# Altium schematic sheet controleRemoto.SchDoc
size A4; DrawnBy: Dyego; Revision: 1; SheetNumber: 1; SheetTotal: 1; ProjectName: Fut Solar
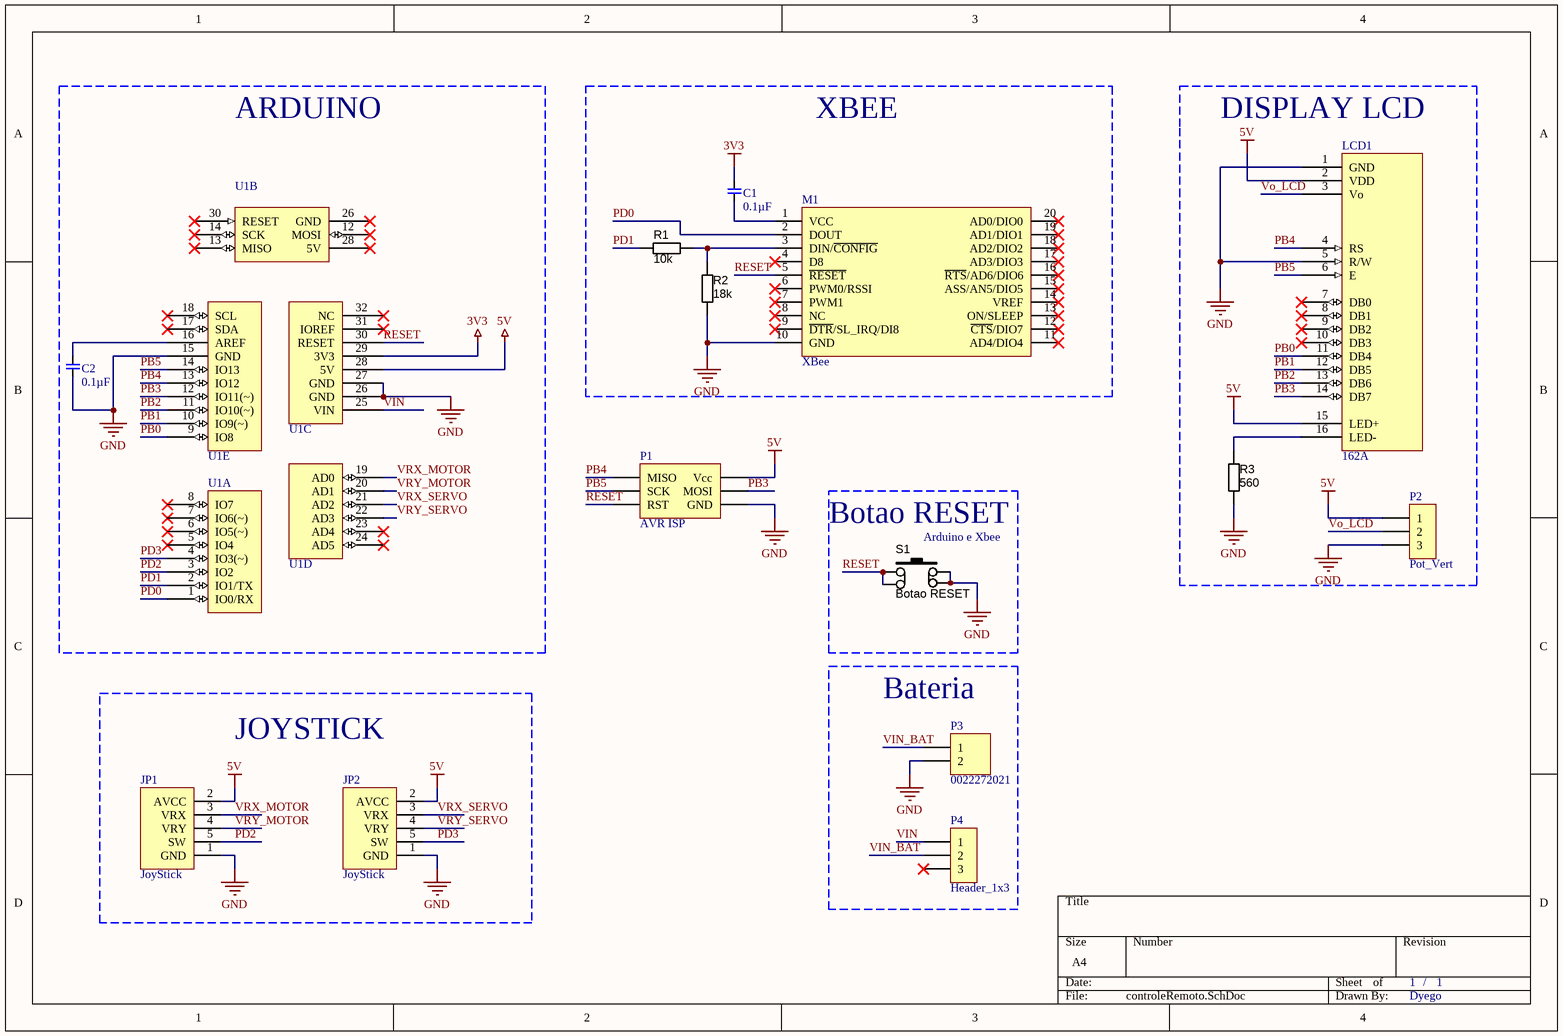
[diagram p0: controleRemoto.SchDoc]

## Parts
C1  0.1µF  [C100-200-100]
C2  0.1µF  [C100-200-100]
JP1  JoyStick  [Modulo Joystick Dual Eixo XY]
JP2  JoyStick  [Modulo Joystick Dual Eixo XY]
LCD1  162A  [DISPLAY 16x2]
M1  XBee  [XBee]
P1  AVR ISP  [HDR-M-2x3-2.54mm-180-9.2mm]
P2  Pot_Vert  [Pot_Vert]
P3  0022272021  [KK_2]
P4  Header_1x3  [Chave Alavanca MTS103]
R1  10k  [RESTH_AXIAL-0.4]
R2  18k  [RESTH_AXIAL-0.4]
R3  560  [RESTH_AXIAL-0.4]
S1  Botao RESET  [DTS-6.0mm-6.0mm-THT]
U1  Shield Arduino Uno Rv3 1  [Shield Arduino Uno Rv3 1]  (value not drawn)  (parts A,B,C,D,E of 5)

## Blocks framed on the sheet
ARDUINO: C2 U1
XBEE: C1 M1 R1 R2
DISPLAY LCD: LCD1 P2 R3
Botao RESET: S1
Bateria: P3 P4
JOYSTICK: JP1 JP2

## Nets
3V3: C1.2 U1.29(3V3)
5V: JP1.2(AVCC) JP2.2(AVCC) LCD1.2(VDD) LCD1.15(LED+) P1.2(Vcc) P2.1 U1.28(5V)
GND: C2.1 JP1.1(GND) JP2.1(GND) LCD1.1(GND) LCD1.5(R/W) M1.10(GND) P1.6(GND) P2.3 P3.2 R2.2 R3.2 S1.2 U1.15(GND) U1.26(GND) U1.27(GND)
PB0: LCD1.11(DB4) U1.9(IO8)
PB1: LCD1.12(DB5) U1.10(IO9(~))
PB2: LCD1.13(DB6) U1.11(IO10(~))
PB3: LCD1.14(DB7) P1.4(MOSI) U1.12(MOSI)
PB4: LCD1.4(RS) P1.1(MISO) U1.13(MISO)
PB5: LCD1.6(E) P1.3(SCK) U1.14(SCK)
PD0: M1.2(DOUT) U1.1(IO0/RX)
PD1: R1.1 U1.2(IO1/TX)
PD2: JP1.5(SW) U1.3(IO2)
PD3: JP2.5(SW) U1.4(IO3(~))
RESET: M1.5(~{RESET}) P1.5(RST) S1.1 U1.30(RESET)
VIN: P4.1 U1.25(VIN)
VIN_BAT: P3.1 P4.2
Vo_LCD: LCD1.3(Vo) P2.2
VRX_MOTOR: JP1.3(VRX) U1.19(AD0)
VRX_SERVO: JP2.3(VRX) U1.21(AD2)
VRY_MOTOR: JP1.4(VRY) U1.20(AD1)
VRY_SERVO: JP2.4(VRY) U1.22(AD3)
NetC1_1: C1.1 M1.1(VCC)
NetC2_2: C2.2 U1.16(AREF)
NetLCD1_16: LCD1.16(LED-) R3.1
NetM1_3: M1.3(DIN/~{CONFIG}) R1.2 R2.1

Not connected (* = marked no-connect by the designer): LCD1 7(DB0)* 8(DB1)* 9(DB2)* 10(DB3)*; M1 4(D8)* 6(PWM0/RSSI)* 7(PWM1)* 8(NC)* 9(~{DTR}/SL_IRQ/DI8)* 11(AD4/DIO4)* 12(~{CTS}/DIO7)* 13(ON/SLEEP)* 14(VREF)* 15(ASS/AN5/DIO5)* 16(~{RTS}/AD6/DIO6)* 17(AD3/DIO3)* 18(AD2/DIO2)* 19(AD1/DIO1)* 20(AD0/DIO0)*; P4 3*; U1 5(IO4)* 6(IO5(~))* 7(IO6(~))* 8(IO7)* 17(SDA)* 18(SCL)* 23(AD4)* 24(AD5)* 31(IOREF)* 32(NC)*

## Notes on the sheet
- (near S1) Arduino e Xbee
- /

## Library data of the parts
C1 C2 = C320C104K1R5TA7301: Non-polarised capacitor; Manufacturer 1: Kemet; Description 1: CAP CER 0.1UF 100V 10% RADIAL; Category 1: Capacitors; Tolerance: ±10%; Voltage - Rated: 100V; Temperature Coefficient: X7R; Código: C320C104K1R5TA7301; PackageReference: C100-200-100; Supplier 1: Digi-Key; Supplier Part Number 1: 399-9868-1-ND; Manufacturer Part Number: C320C104K1R5TA7301; RoHS: RoHS Compliant; Stock 1: 9646; Pricing 1: 1=0.51, 10=0.49, 25=0.3468, 50=0.2922, 100=0.2375, 250=0.19728, 1000=0.16119 (EUR); Packaging: Cut Tape (CT); Capacitance: 0.1µF; Operating Temperature: -55°C ~ 125°C; Applications: General Purpose; Lead Spacing: 0.100" (2.54mm); Size / Dimension: 0.200" L x 0.125" W (5.08mm x 3.18mm); Height - Seated (Max): 0.260" (6.60mm); Mounting Type: Through Hole; Package / Case: Radial; ComponentLink1URL: http://www.kemet.com/Lists/ProductCatalog/Attachments/52/F3101_GoldMax.pdf; ComponentLink1Description: http://www.kemet.com/Lists/ProductCatalog/Attachments/52/F3101_GoldMax.pdf; Ratings: -; Thickness (Max): -; Features: -; Lead Style: Straight
JP1 JP2 = JoyStick: Description 1: Módulo Joystick Dual Eixo XY; Código: JoyStick; ManufacturerPartNumber: JoyStick; PackageReference: Modulo Joystick Dual Eixo XY; Manufacturer 1: JoyStick
LCD1 = LCM-S01602DTR/A: 16 char * 2 line LCD character display with b/light; Manufacturer 1: LUMEX; Fitted: True; Description 1: LUMEX - LCM-S01602DTR/A - DOT MATRIX LCD DISPLAY 16X2; Character Count x Line: 16 x 2; Backlighting Colour: No Backlight; Character Size: 5.56; Supply Voltage: 5; Display Mode: Reflective; Display Area Width: 52; Código: LCM-S01602DTR/A; ManufacturerPartNumber: LCM-S01602DTR/A; Footprint: DISPLAY 16X2; PackageReference: DISPLAY 16X2; Supplier 1: Newark; Supplier Part Number 1: 19J7660; RoHS: YES; Stock 1: 118; Pricing 1: 1=7,47, 5=7,47, 10=6,89, 100=6,89 (USD); ComponentLink1URL: http://www.farnell.com/datasheets/699613.pdf; ComponentLink1Description: http://www.farnell.com/datasheets/699613.pdf; Packaging: Each
M1 = XB24CZ7WIT-004: XBee RF Multipoint Module; Manufacturer 1: Digi International; Description 1: Zigbee / 802.15.4 Modules XBee ZB S2C TH Wire Antenna; Category 1: Zigbee / 802.15.4 Modules; Data Rate: 250 kbps; Frequency: 2.4 GHz; Sensitivity: - 100 dBm; Interface Type: SPI, UART; Operating Supply Voltage: 2.1 V to 3.6 V; Line of Sight Range: 4000 ft; Output Power: 3.1 mW; Antenna Connector Type: Integrated; Supply Current Receiving: 28 mA; Supply Current Transmitting: 33 mA; Product Status: New Product; Código: XB24CZ7WIT-004; ManufacturerPartNumber: XB24CZ7WIT-004; PackageReference: XBee; Supplier 1: Mouser; Supplier Part Number 1: 888-XB24CZ7WIT-004; RoHS: RoHS Compliant; Stock 1: 200; Pricing 1: 1=25.99 (AUD); Packaging: Tray; ComponentLink1URL: http://www.mouser.com/ds/2/111/ds_xbee_zigbee-709350.pdf; ComponentLink1Description: http://www.mouser.com/ds/2/111/ds_xbee_zigbee-709350.pdf; Brand: Digi International; Maximum Operating Temperature: + 85 C; Minimum Operating Temperature: - 40 C; RoHS - Mouser: Y; Minimum Order Quantity: 1; Reeling: False; Dimensions: 2.761 cm x 2.438 cm
P1 = AVR_ISP: ARV ISP Connector; Código: AVR_ISP; ManufacturerPartNumber: AVR_ISP; PackageReference: HDR-M-2x3-2.54mm-180-9.2mm
P2 = Potenciometro vertical: Header, 1 Line, 3 Columns, 3 Pins; Código: Potenciometro vertical; PackageReference: Pot_Vert; Description 1: Potenciometro vertical
P3 = 0022272021: Manufacturer 1: Molex Inc; Description 1: CONN HEADER KK 2POS .100 VERT TIN; Category 1: Connectors, Interconnects; Supplier 1: Digi-Key; RoHS: RoHS Compliant; Stock 1: 34437; Pricing 1: 1=0.25, 10=0.241, 25=0.2056, 50=0.18, 100=0.167, 250=0.14776, 500=0.14134, 1000=0.11564 (EUR); Supplier Part Number 1: WM4111-ND; Código: 0022272021; ManufacturerPartNumber: 0022272021; PackageReference: KK_2
P4 = New Component: Header, 1 Line, 3 Columns, 3 Pins; ManufacturerPartNumber: Chave alavanca; Código: New Component; PackageReference: Chave Alavanca MTS103; Description 1: Chave alavanca
R1 = CF18JT10K0: Resistor; Manufacturer 1: Stackpole Electronics Inc; Description 1: RES 10K OHM 1/8W 5% CARBON FILM; Category 1: Resistors; Tolerance: ±5%; Power (Watts): 0.125W, 1/8W; Temperature Coefficient: 0/ -500ppm/°C; Código: CF18JT10K0; Resistance: 10k; PackageReference: RESTH_AXIAL-0.4; Supplier 1: Digi-Key; Supplier Part Number 1: CF18JT10K0TR-ND; Manufacturer Part Number: CF18JT10K0; RoHS: RoHS Compliant; Stock 1: 50000; Pricing 1: 5000=0.00593, 10000=0.00515, 25000=0.00452, 50000=0.00415, 125000=0.00406 (EUR); Packaging: Tape & Reel (TR); Composition: Carbon Film; Features: Flame Retardant Coating, Safety; Operating Temperature: -55°C ~ 155°C; Package / Case: Axial; Supplier Device Package: Axial; Size / Dimension: 0.067" Dia x 0.130" L (1.70mm x 3.30mm); Height: -; Number of Terminations: 2; ComponentLink1URL: http://www.seielect.com/catalog/SEI-CF_CFM.pdf; ComponentLink1Description: http://www.seielect.com/catalog/SEI-CF_CFM.pdf
R2 = CF18JT18K0: Resistor; Manufacturer 1: Stackpole Electronics Inc; Description 1: RES 18K OHM 1/8W 5% CARBON FILM; Category 1: Resistors; Tolerance: ±5%; Power (Watts): 0.125W, 1/8W; Temperature Coefficient: 0/ -500ppm/°C; Código: CF18JT18K0; Resistance: 18k; PackageReference: RESTH_AXIAL-0.4; Supplier 1: Digi-Key; Supplier Part Number 1: CF18JT18K0TR-ND; Manufacturer Part Number: CF18JT18K0; RoHS: RoHS Compliant; Stock 1: 5000; Pricing 1: 5000=0.00593, 10000=0.00515, 25000=0.00452, 50000=0.00415, 125000=0.00406 (EUR); Packaging: Tape & Reel (TR); Composition: Carbon Film; Features: Flame Retardant Coating, Safety; Operating Temperature: -55°C ~ 155°C; Package / Case: Axial; Supplier Device Package: Axial; Size / Dimension: 0.067" Dia x 0.130" L (1.70mm x 3.30mm); Height: -; Number of Terminations: 2; ComponentLink1URL: http://www.seielect.com/catalog/SEI-CF_CFM.pdf; ComponentLink1Description: http://www.seielect.com/catalog/SEI-CF_CFM.pdf
R3 = CF18JT560R: Resistor; Manufacturer 1: Stackpole Electronics Inc; Description 1: RES 560 OHM 1/8W 5% CARBON FILM; Category 1: Resistors; Tolerance: ±5%; Power (Watts): 0.125W, 1/8W; Temperature Coefficient: 0/ -400ppm/°C; Código: CF18JT560R; Resistance: 560; PackageReference: RESTH_AXIAL-0.4; Supplier 1: Digi-Key; Supplier Part Number 1: CF18JT560RTR-ND; Manufacturer Part Number: CF18JT560R; RoHS: RoHS Compliant; Stock 1: 0; Pricing 1: 5000=0.00593, 10000=0.00515, 25000=0.00452, 50000=0.00415, 125000=0.00406 (EUR); Packaging: Tape & Reel (TR); Composition: Carbon Film; Features: Flame Retardant Coating, Safety; Operating Temperature: -55°C ~ 155°C; Package / Case: Axial; Supplier Device Package: Axial; Size / Dimension: 0.067" Dia x 0.130" L (1.70mm x 3.30mm); Height: -; Number of Terminations: 2; ComponentLink1URL: http://www.seielect.com/catalog/SEI-CF_CFM.pdf; ComponentLink1Description: http://www.seielect.com/catalog/SEI-CF_CFM.pdf
S1 = ADTS648NV: Manufacturer 1: Apem Inc.; Description 1: SWITCH TACTILE SPST-NO 0.05A 12V; Category 1: Switches; Circuit: SPST-NO; Switch Function: Off-Mom; Contact Rating @ Voltage: 0.05A @ 12VDC; Actuator Type: Plunger for Cap; Actuator Height off PCB, from Pins: 7.30mm; Actuator Orientation: Top Actuated; Outline: 6.20mm x 6.20mm; Illumination: Non-Illuminated; Operating Force: 160gf; Actuator Material: Polyamide (PA), Nylon; Switch Travel: 0.25mm; Código: ADTS648NV; ManufacturerPartNumber: ADTS648NV; PackageReference: DTS-6.0mm-6.0mm-THT; Supplier 1: Digi-Key; Supplier Part Number 1: 679-2376-ND; RoHS: RoHS Compliant; Stock 1: 906; Pricing 1: 1=0.5, 10=0.468, 50=0.4652, 100=0.3815, 250=0.34684, 500=0.3295, 1000=0.26013, 5000=0.24279 (EUR); Packaging: Bulk; Mounting Type: Through Hole; Termination Style: PC Pin; Illumination Voltage (Nominal): -; Illumination Type, Color: -; Ingress Protection: -; Features: Tactile Feedback; Mechanical Life: -; Operating Temperature: -25°C ~ 70°C; ComponentLink1URL: http://www.apem.com/files/apem/brochures/ADTS6-ADTSM-KTSC6.pdf; ComponentLink1Description: http://www.apem.com/files/apem/brochures/ADTS6-ADTSM-KTSC6.pdf
U1 = Shield Arduino Uno Rv3 1: Description 1: Shield Arduino Uno Rv3 - Sem SPI; Código: Shield Arduino Uno Rv3 1; ManufacturerPartNumber: Shield Arduino Uno Rv3 1; PackageReference: Shield Arduino Uno Rv3 1